# Altium schematic sheet Full-Wave Rectifier.schdoc: Title
size A4; Date: Date; CheckedBy: Checked By; SheetNumber: x; SheetTotal: y; DesignedBy: Designed By
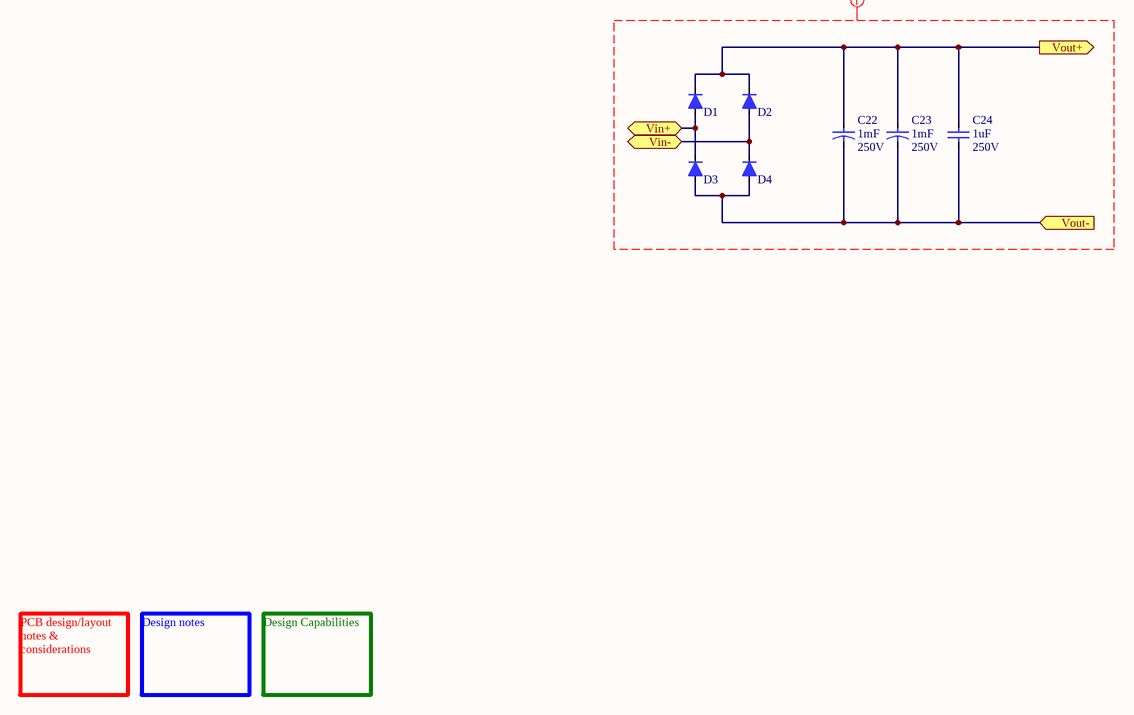
[diagram p0: Full-Wave Rectifier.schdoc]

## Parts
C22  Capacitance: 1mF  Voltage: 250V  (hidden comment: 1mF Radial 250V)
C23  Capacitance: 1mF  Voltage: 250V  (hidden comment: 1mF Radial 250V)
C24  Voltage - Rated: 250V  Capacitance: 1uF  (hidden comment: 1uF 2220 250V)
D1  Diode - Signal 1A  (value not drawn)
D2  Diode - Signal 1A  (value not drawn)
D3  Diode - Signal 1A  (value not drawn)
D4  Diode - Signal 1A  (value not drawn)

## Ports
Vin+ (bidir), Vin- (bidir), Vout+ (out), Vout- (in)

## Nets
Vin+: D1.1(Anode) D3.2(Cathode) ; port Vin+
Vin-: D2.1(Anode) D4.2(Cathode) ; port Vin-
Vout+: C22.1 C23.1 C24.1 D1.2(Cathode) D2.2(Cathode) ; port Vout+
Vout-: C22.2 C23.2 C24.2 D3.1(Anode) D4.1(Anode) ; port Vout-

## Layout directives
net class 171-250V: (no net found under the mark)

## Notes on the sheet
- PCB design/layout notes & considerations
- Design notes
- Design Capabilities
- Repository Version
- BOM/Variant

## Library data of the parts
C22 C23 = 1mF Radial 250V: Polarized; Manufacturer: Nichicon; Manufacturer Part Number: LGG2E102MELB40; Tolerance: ±20%; Lifetime @ Temp.: 2000 Hrs @ 105°C; Polarization: Polar; Ripple Current - Low Frequency: 2.2A @ 120Hz; Ripple Current - High Frequency: 3.3A @ 50kHz; Value: 1mF Radial 250V; Supplier 1: Digi-Key; RoHS: RoHS Compliant; Category: Capacitors; Stock 1: 221; Pricing 1: 1=4.59, 10=4.129, 100=3.1198, 500=2.56926, 1000=2.38575, 2500=2.37701 (USD); Packaging: Bulk; Part Status: Active; ESR (Equivalent Series Resistance): -; Operating Temperature: -40°C ~ 105°C; Applications: General Purpose; Lead Spacing: 0.394" (10.00mm); Size / Dimension: 1.181" Dia (30.00mm); Height - Seated (Max): 1.654" (42.00mm); Surface Mount Land Size: -; Mounting Type: Through Hole; Package / Case: Radial, Can - Snap-In; ComponentLink1URL: http://nichicon-us.com/english/products/pdfs/e-lgg.pdf; ComponentLink1Description: Spec Sheet; Supplier Part Number 1: 493-8169-ND
C24 = 1uF 2220 250V: Non-polarized; Manufacturer: Murata Electronics North America; Manufacturer Part Number: GRM55DR72E105KW01L; Tolerance: ±10%; Temperature Coefficient: X7R; Value: 1uF 2220 250V; Supplier 1: Digi-Key; RoHS: RoHS Compliant; Category: Capacitors; Stock 1: 174481; Pricing 1: 1=0.89, 10=0.678, 100=0.4853, 500=0.3757 (USD); Packaging: Cut Tape (CT); Part Status: Active; Operating Temperature: -55°C ~ 125°C; Features: -; Ratings: -; Applications: General Purpose; Mounting Type: Surface Mount, MLCC; Package / Case: 2220 (5750 Metric); Size / Dimension: 0.224" L x 0.197" W (5.70mm x 5.00mm); Height - Seated (Max): -; Thickness (Max): 0.087" (2.20mm); Lead Spacing: -; Lead Style: -; ComponentLink1URL: http://search.murata.co.jp/Ceramy/image/img/A01X/G101/ENG/GRM55DR72E105KW01-01.pdf; ComponentLink1Description: Spec Sheet; Supplier Part Number 1: 490-3550-1-ND
D1-D4 = Diode - Signal 1A: Signal Diode; Manufacturer: Vishay Semiconductor Diodes Division; Manufacturer Part Number: US1G-E3/5AT; Diode Type: Standard; Voltage - DC Reverse (Vr) (Max): 400V; Voltage - Forward (Vf) (Max) @ If: 1V @ 1A; Speed: Fast Recovery =< 500ns, > 200mA (Io); Reverse Recovery Time (trr): 50ns; Current - Reverse Leakage @ Vr: 10µA @ 400V; Capacitance @ Vr, F: 15pF @ 4V, 1MHz; Supplier 1: Digi-Key; Supplier Part Number 1: US1G-E3/5ATGICT-ND; RoHS: RoHS Compliant; Category: Discrete Semiconductor Products; Stock 1: 29002; Pricing 1: 1=0.41, 10=0.312, 25=0.2816, 100=0.1945, 250=0.1638, 500=0.1331, 1000=0.10238, 2500=0.09214 (USD); Packaging: Cut Tape (CT); Part Status: Active; Current - Average Rectified (Io): 1A; Mounting Type: Surface Mount; Package / Case: DO-214AC, SMA; Supplier Device Package: DO-214AC (SMA); Operating Temperature - Junction: -55°C ~ 150°C; ComponentLink1URL: http://www.vishay.com/docs/88768/us1.pdf; ComponentLink1Description: Spec Sheet